# EasyEDA Pro project ProPrj_ProDocument_IO_Board_v3.1_2024-08-01_2024-12-08.epro

# Schematic IO_Board_v3.1
Create Date: 2024-11-05; Page Name: 1. 3.1; Project Name: ProDocument_IO_Board_v3.1_2024-08-01; Schematic Name: IO_Board_v3.1; Update Date: 2024-12-08
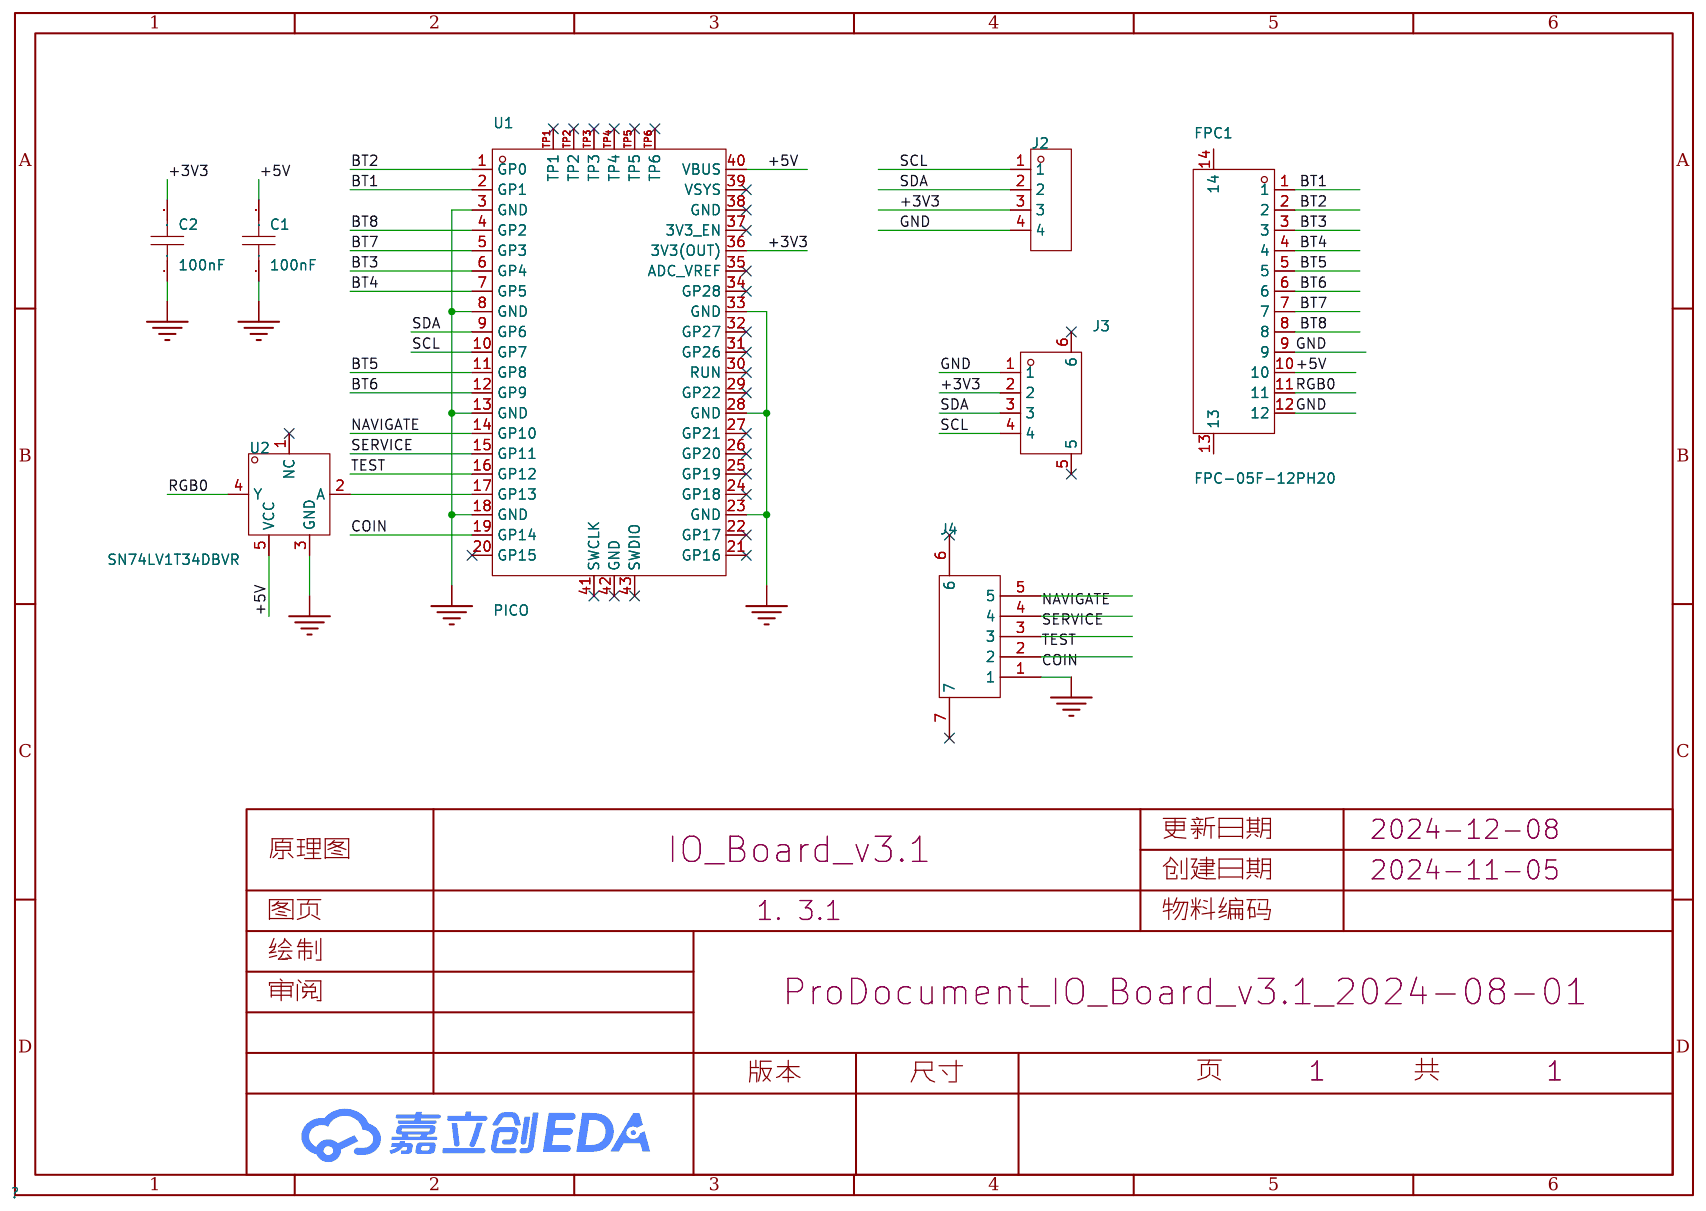
[diagram p0: schematic sheet]

## Parts
C1  100nF  [C0603]
C2  100nF  [C0603]
FPC1  FPC-05F-12PH20  [FPC-SMD_12P-P0.50_FPC-05F-12PH20]
J2  F136-1104S3CMUB2  [CONN-SMD_4P-P2.54_XH2.54-4AB]
J3  AFA01-S04FCA-00  [FPC-SMD_4P-P1.00_JS_AFA01-S04FCA-00]
J4  AFA01-S05FCC-00  [FPC-SMD_P1.00-5P_FGS-XJ-H2.0]
U1  PICO  [COMM-SMD_L51.0-W21.0-P2.54_SC0916]
U2  SN74LV1T34DBVR  [SOT-23-5_L2.9-W1.6-P0.95-LS2.8-BR]

## Library data of the parts
C1 C2 = CAP_0603: Supplier Footprint: 0603
FPC1 = FPC-05F-12PH20: 锁定特性:翻盖式;触点类型:下接;触点数量:12P;间距:0.5mm;安装类型:卧贴;工作温度范围:-25℃~+85℃;; LCSC Part Name: 间距:0.5mm P数:12P 翻盖式 下接; Supplier Part: C2856799; Manufacturer: XUNPU(讯普); Supplier Footprint: SMD,P=0.5mm,卧贴; JLCPCB Part Class: 扩展库; Datasheet: https://atta.szlcsc.com/upload/public/pdf/source/20210922/C2856799_794322F63241F1C59819430844B946BA.pdf; Supplier: LCSC; Locking Feature: 翻盖式; Contact Type: 下接; Number of Contacts: 12P; Pitch: 0.5mm; Mounting Type: 卧贴; FFC, FCB Thickness: 0.3mm; Height Above Board: 2mm; Operating Temperature Range: -25℃~+85℃
J2 = F136-1104S3CMUB2: 插孔结构:1x4P;间距:2.54mm;排数:单排;总孔位数:4P;塑高:3.5mm;触头材质:青铜;触头镀层:锡;工作温度范围:-40℃~+105℃;; LCSC Part Name: 1x4P 间距:2.54mm; Supplier Part: C20071191; Manufacturer: Yxcon(宇熙精密); Supplier Footprint: SMD,P=2.54mm(交错脚); JLCPCB Part Class: 扩展库; Datasheet: https://atta.szlcsc.com/upload/public/pdf/source/20231229/6268F0CB0A5C868446EF560AB6378120.pdf; Supplier: LCSC; Holes Structure: 1x4P; Pitch: 2.54mm; Number of Rows: 单排; Number of Holes: 4P; Insulation Height: 3.5mm; Contact Material: 青铜; Contact Plating: 锡; Operating Temperature Range: -40℃~+105℃
J3 = AFA01-S04FCA-00: 锁定特性:翻盖式;触点类型:下接;触点数量:4P;间距:1mm;安装类型:卧贴;工作温度范围:-20℃~+85℃;; LCSC Part Name: 间距:1mm P数:4P 翻盖式 下接; Supplier Part: C262752; Manufacturer: JS(钜硕电子); Supplier Footprint: SMD,P=1mm,卧贴; JLCPCB Part Class: 扩展库; Datasheet: https://atta.szlcsc.com/upload/public/pdf/source/20180820/C262762_EBECD0847A529CA64FD00527F6604CA9.pdf; Supplier: LCSC; Locking Feature: 翻盖式; Contact Type: 下接; Number of Contacts: 4P; Pitch: 1mm; Mounting Type: 卧贴; FFC, FCB Thickness: 0.3mm; Height Above Board: 2mm; Operating Temperature Range: -20℃~+85℃
J4 = AFA01-S05FCC-00: 锁定特性:翻盖式;触点类型:下接;触点数量:5P;间距:1mm;安装类型:卧贴;; LCSC Part Name: 间距:1mm P数:5P 翻盖式 下接; Supplier Part: C262382; Manufacturer: JS(钜硕电子); Supplier Footprint: SMD,P=1mm,卧贴; JLCPCB Part Class: 扩展库; Datasheet: https://atta.szlcsc.com/upload/public/pdf/source/20180820/C262762_EBECD0847A529CA64FD00527F6604CA9.pdf; Supplier: LCSC; Locking Feature: 翻盖式; Contact Type: 下接; Number of Contacts: 5P; Pitch: 1mm; Mounting Type: 卧贴; FFC, FCB Thickness: 0.3mm; Height Above Board: 2mm
U1 = PICO: "基于Raspberry Pi RP2040芯片设计；处理器：双核Arm Cortex-M0+ @ 133MHz内存：264KB片上SRAM；2MB板上QSPI闪存接口：26个GPIO引脚，包括3个模拟输入；2 × UART；2 × SPI控制器；2 × I2C控制器；16个PWM通道；1 × USB 1.1控制器和PHY，支持主机和设备；8 × PIO状态机"; Supplier Part: C7203002; Manufacturer: Raspberry Pi(树莓派); JLCPCB Part Class: 扩展库; Datasheet: https://atta.szlcsc.com/upload/public/pdf/source/20230906/086376002DDC9866828648BC93E51F8B.pdf; Supplier: LCSC
U2 = SN74LV1T34DBVR: 输入类型:-;电源电压:1.6V~5.5V;元件数:1;每个元件位数:1;灌电流(IOL):8mA;拉电流(IOH):8mA;; Supplier Part: C100024; Manufacturer: TI(德州仪器); Supplier Footprint: SOT-23-5; JLCPCB Part Class: 扩展库; Datasheet: https://www.ti.com/cn/lit/gpn/sn74lv1t34; Supplier: LCSC; output type: 推挽; Supply Voltage: 1.6V~5.5V; Number of Elements: 1; Number of Bits per Element: 1; Sink Current: 8mA; Source Current: 8mA; Logic Family: 74LV; Operating Temperature: -40℃~+125℃

## Nets
+3V3: C2.2 J2.3 J3.2 U1.36(3V3(OUT))
+5V: C1.2 FPC1.10 U1.40(VBUS) U2.5(VCC)
GND: C1.1 C2.1 FPC1.9 FPC1.12 J2.4 J3.1 J4.1 U1.3(GND) U1.8(GND) U1.13(GND) U1.18(GND) U1.23(GND) U1.28(GND) U1.33(GND) U2.3(GND)
BT1: FPC1.1 U1.2(GP1)
BT2: FPC1.2 U1.1(GP0)
BT3: FPC1.3 U1.6(GP4)
BT4: FPC1.4 U1.7(GP5)
BT5: FPC1.5 U1.11(GP8)
BT6: FPC1.6 U1.12(GP9)
BT7: FPC1.7 U1.5(GP3)
BT8: FPC1.8 U1.4(GP2)
COIN: J4.2 U1.19(GP14)
NAVIGATE: J4.5 U1.14(GP10)
RGB0: FPC1.11 U2.4(Y)
SCL: J2.1 J3.4 U1.10(GP7)
SDA: J2.2 J3.3 U1.9(GP6)
SERVICE: J4.4 U1.15(GP11)
TEST: J4.3 U1.16(GP12)
$1N1134: U1.17(GP13) U2.2(A)

Not connected (* = marked no-connect by the designer): FPC1 13 14; J3 5* 6*; J4 6* 7*; U1 20(GP15)* 21(GP16)* 22(GP17)* 24(GP18)* 25(GP19)* 26(GP20)* 27(GP21)* 29(GP22)* 30(RUN)* 31(GP26)* 32(GP27)* 34(GP28)* 35(ADC_VREF)* 37(3V3_EN)* 38(GND)* 39(VSYS)* 41(SWCLK)* 42(GND)* 43(SWDIO)* TP1* TP2* TP3* TP4* TP5* TP6*; U2 1(NC)*

# Board IO_Board_v3.1
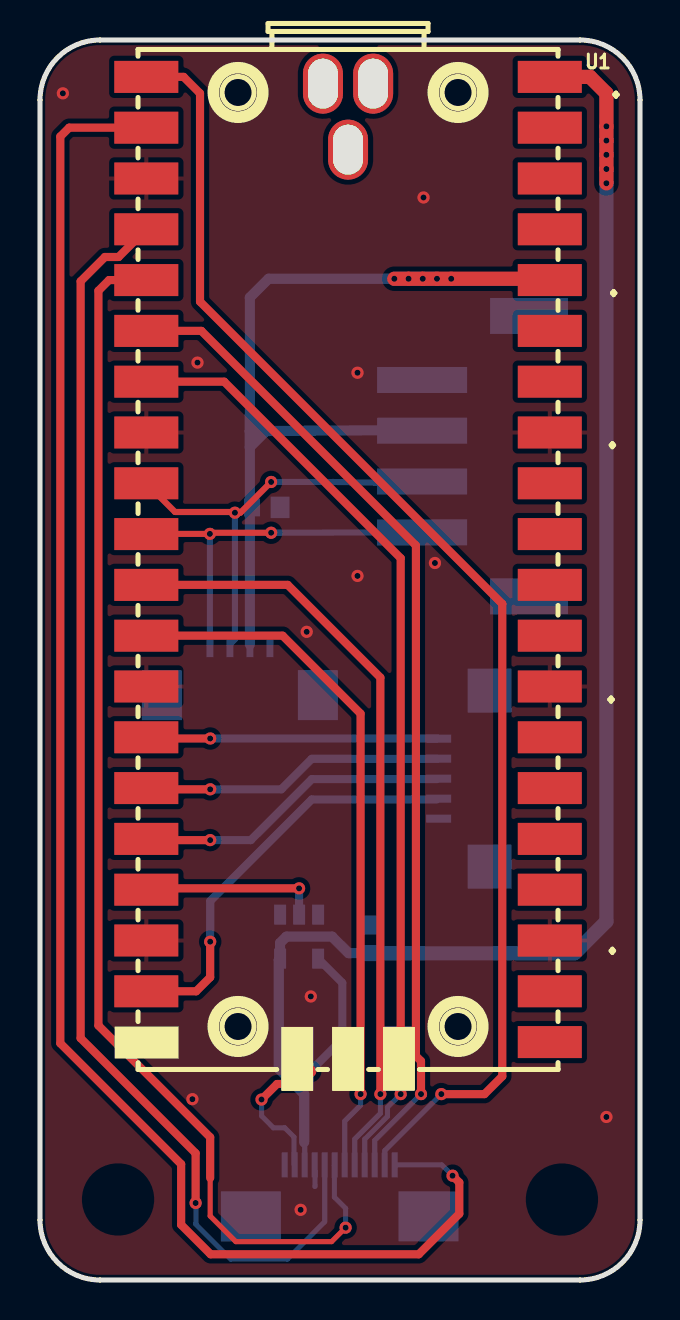
[diagram p1: board, top side]
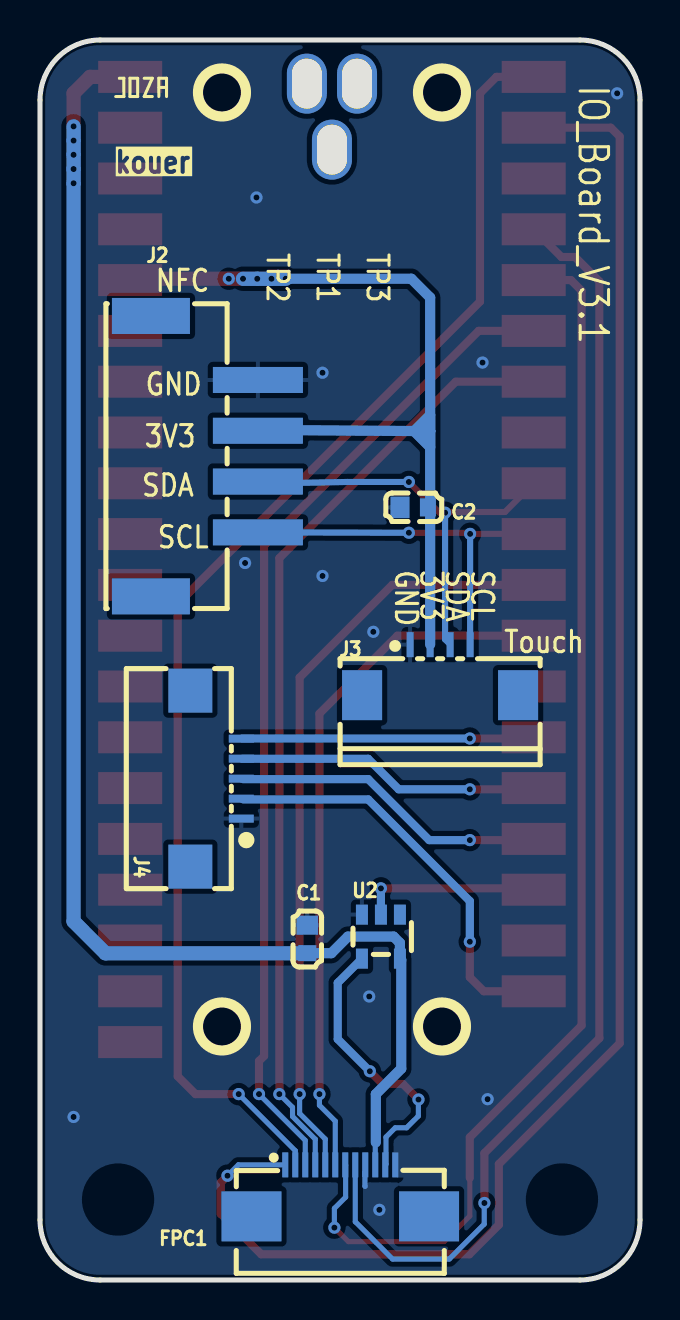
[diagram p2: board, bottom side, seen from below]

Outline 30 x 62 mm; copper layers: Top Layer, Bottom Layer. Coordinates in mm from the lower left corner of the outline.
Outline path: 0,59 0,3 arc(0.88,0.88) 3,0 27,0 arc(29.12,0.88) 30,3 30,59 arc(29.12,61.12) 27,62 3,62 arc(0.88,61.12) 0,59
Stack: Top Layer 0.035mm / Dielectric1 1.51mm FR4 er 4.5 / Bottom Layer 0.035mm

## Design rules (mm)
template: JLCPCB Capability(Two Layers Board)
spacing copperThickness1oz (default): track to track 0.102, other pairs 0.152 to 0.3
spacing copperThickness2oz: track to track 0.203, other pairs 0.152 to 0.3
track width copperThickness1oz (default): min 0.127, default 0.254, max 2.54
track width copperThickness2oz: min 0.203, default 0.254, max 2.54
differential pair differentialPair (default): width min 0.127, default 0.254, max 2.54; gap min 0.152, default 0.152
via viaSize (default): diameter min 0.5, default 0.61, max 10; hole min 0.3, default 0.305, max 6.3

## Placement (name value [footprint] x y rotation side)
C1  100nF  [C0603]  16.64 17.04 270 bottom
C2  100nF  [C0603]  11.3 38.63 180 bottom
FPC1  FPC-05F-12PH20  [FPC-SMD_12P-P0.50_FPC-05F-12PH20]  14.99 4.47 180 bottom
J2  F136-1104S3CMUB2  [CONN-SMD_4P-P2.54_XH2.54-4AB]  21.78 41.19 90 bottom
J3  AFA01-S04FCA-00  [FPC-SMD_4P-P1.00_JS_AFA01-S04FCA-00]  9.99 30.5 180 bottom
J4  AFA01-S05FCC-00  [FPC-SMD_P1.00-5P_FGS-XJ-H2.0]  21.21 25.07 90 bottom
NOREF  -  [Pad_e26]  16.66 59.82 90 top
NOREF#2  -  [Pad_e27]  14.15 59.82 90 top
NOREF#3  -  [Pad_e419]  15.4 56.52 90 top
U1  PICO  [COMM-SMD_L51.0-W21.0-P2.54_SC0916]  15.4 35.71 270 top
U2  SN74LV1T34DBVR  [SOT-23-5_L2.9-W1.6-P0.95-LS2.8-BR]  12.95 17.17 90 bottom

## Footprints (pads in the part's own frame, mm; a bottom-side part is the same pattern mirrored in y, then rotated)
C0603
  rect 0.95x1.075 smd: 1(-0.7,0)
  rect 0.8x0.9 smd: 2(0.7,0)
COMM-SMD_L51.0-W21.0-P2.54_SC0916
  rect 1.6x3.2 smd: 1(-24.445,-10.088) 2(-21.905,-10.088) 3(-19.365,-10.088) 4(-16.825,-10.088) 5(-14.285,-10.088) 6(-11.745,-10.088) 7(-9.205,-10.088) 8(-6.665,-10.088) 9(-4.125,-10.088) 10(-1.585,-10.088) 11(0.955,-10.088) 12(3.495,-10.088) 13(6.035,-10.088) 14(8.575,-10.088) 15(11.115,-10.088) 16(13.655,-10.088) 17(16.195,-10.088) 18(18.735,-10.088) 19(21.275,-10.088) 21(23.815,10.088) 22(21.275,10.088) 23(18.735,10.088) 24(16.195,10.088) 25(13.655,10.088) 26(11.115,10.088) 27(8.575,10.088) 28(6.035,10.088) 29(3.495,10.088) 30(0.955,10.088) 31(-1.585,10.088) 32(-4.125,10.088) 33(-6.665,10.088) 34(-9.205,10.088) 35(-11.745,10.088) 36(-14.285,10.088) 37(-16.825,10.088) 38(-19.365,10.088) 39(-21.905,10.088) 40(-24.445,10.088)
CONN-SMD_4P-P2.54_XH2.54-4AB
  rect 1.3x4.501 smd: 1(-3.81,-2.675) 2(-1.27,-2.675) 3(1.27,-2.675) 4(3.81,-2.675)
  rect 1.801x3.899 smd: 5(-7.011,2.675) 6(7.011,2.675)
FPC-SMD_4P-P1.00_JS_AFA01-S04FCA-00
  rect 0.35x1.25 smd: 1(-1.5,1.262) 2(-0.5,1.262) 3(0.499,1.262) 4(1.5,1.262)
  rect 2x2.5 smd: 5(3.9,-1.262) 6(-3.9,-1.262)
FPC-SMD_12P-P0.50_FPC-05F-12PH20
  rect 0.3x1.25 smd: 1(-2.75,1.288) 2(-2.25,1.288) 3(-1.75,1.288) 4(-1.25,1.288) 5(-0.75,1.288) 6(-0.25,1.288) 7(0.25,1.288) 8(0.75,1.288) 9(1.25,1.288) 10(1.75,1.288) 11(2.25,1.288) 12(2.75,1.288)
  rect 3x2.5 smd: 13(4.44,-1.288) 14(-4.44,-1.288)
FPC-SMD_P1.00-5P_FGS-XJ-H2.0
  rect 0.4x1.25 smd: 1(-2,-1.275) 2(-1.002,-1.274) 3(-0.002,-1.274) 4(0.998,-1.274) 5(1.998,-1.274)
  rect 2.2x2.2 smd: 6(4.4,1.275) 7(-4.4,1.275)
Pad_e26
  oval 3x2 hole 2.5x1.5: 44(0,0)
Pad_e27
  oval 3x2 hole 2.5x1.5: 45(0,0)
Pad_e419
  oval 3x2 hole 2.5x1.5: 45(0,0)
SOT-23-5_L2.9-W1.6-P0.95-LS2.8-BR
  rect 1x0.6 smd: 1(1.1,-0.95) 2(1.1,0) 3(1.1,0.95) 4(-1.1,0.95) 5(-1.1,-0.95)

## Nets
As in the schematic.

Pads without a net: FPC1 13 14; J2 5 6; J3 5 6; J4 6 7; U1 21 22 24 25 26 27 29 30 31 32 34 35 37 38 39; U2 1

## Via types
v1: diameter 0.61, hole 0.305, Top Layer to Bottom Layer, 40 vias

## Routing (per net, layer and track width the routed paths; a pad name or vN(x,y) marks a point on that pad's centre or on a via; arc(x,y) is an arc through that point)
+3V3: length 48
  Top Layer w0.711: v1(17.72,50.06) v1(18.43,50.06) v1(19.14,50.06) v1(19.85,50.06) v1(20.56,50.06) 25.42,50.06 U1.36
  Bottom Layer w0.508: 11.3,42.44 10.49,43.25 10.49,42.44 ; 11.3,42.44 10.49,42.44 ; 11.3,42.44 10.49,42.44 ; 11.3,42.44 10.49,41.64 10.49,42.44 ; 10.49,42.44 10.49,31.78 ; 10.49,42.44 17.97,42.5 18.09,42.38 ; 10.49,42.44 10.49,49.12 11.43,50.06 v1(17.72,50.06)
  Bottom Layer w0.711: v1(17.72,50.06) v1(18.43,50.06) v1(19.14,50.06) v1(19.85,50.06)
+5V: length 76.5
  Top Layer w0.711: v1(28.32,54.84) v1(28.32,55.55) v1(28.32,56.26) v1(28.32,56.97) v1(28.32,57.68) 28.32,59.33 27.5,60.16 U1.40
  Bottom Layer w0.254: 13.21,6.88 13.24,6.85 FPC1.10
  Bottom Layer w0.508: 13.21,6.88 13.21,9.3 11.94,10.56 11.94,16 U2.5 12,16.85 12.32,17.17 14.6,17.17 15.43,16.34 C1.2
  Bottom Layer w0.711: v1(28.32,57.68) v1(28.32,56.97) v1(28.32,56.26) v1(28.32,55.55) v1(28.32,54.84) 28.32,17.93 26.72,16.33 16.64,16.33 C1.2
GND: length 0.8
  Bottom Layer w0.254: 13.74,4.68 13.75,4.69 13.75,5.44
  vias: v1(1.14,59.33) v1(7.62,9.04) v1(7.87,45.87) v1(13.03,3.51) v1(13.34,32.41) v1(13.54,14.18) v1(15.88,45.36) v1(15.88,35.2) v1(19.18,54.13) v1(19.75,35.85) v1(28.32,8.15)
BT1: length 81.9
  Top Layer w0.406: v1(20.63,5.21) 20.96,4.88 20.96,3.31 18.94,1.29 8.53,1.29 7.06,2.76 7.06,5.79 1.02,11.83 1.02,57.17 1.46,57.62 U1.2
  Bottom Layer w0.254: FPC1.1 20.09,5.76 v1(20.63,5.21)
BT2: length 66.6
  Top Layer w0.406: U1.1 7.18,60.16 8,59.33 8,48.92 23.11,33.81 23.11,10.18 22.22,9.3 v1(20.07,9.3)
  Bottom Layer w0.254: FPC1.2 17.24,6.47 v1(20.07,9.3)
BT3: length 50
  Top Layer w0.406: v1(19.05,9.3) 19.05,10.95 18.8,11.2 18.8,36.73 8.07,47.46 U1.6
  Bottom Layer w0.254: v1(19.05,9.3) 16.74,6.98 FPC1.3
BT4: length 47.5
  Top Layer w0.406: U1.7 9.21,44.92 18.03,36.09 v1(18.03,9.3)
  Bottom Layer w0.254: FPC1.4 16.24,7.04 17.37,8.18 17.37,8.64 18,9.26
  Bottom Layer w0.406: 18,9.26 v1(18.03,9.3)
BT5: length 38.5
  Top Layer w0.406: v1(17.02,9.3) 17.02,30.12 12.38,34.76 U1.11
  Bottom Layer w0.254: v1(17.02,9.3) 17.02,8.33 15.74,7.04 FPC1.5
BT6: length 35.2
  Top Layer w0.406: U1.12 12.13,32.22 16.03,28.32 v1(16.03,9.3)
  Bottom Layer w0.254: v1(16.03,9.3) 16.03,8.74 15.24,7.94 FPC1.6
BT7: length 62.2
  Top Layer w0.254: v1(15.28,2.62) 14.58,1.92 9.79,1.92 8.51,3.2 8.51,5.1
  Top Layer w0.406: 8.51,5.1 8.51,7.14 2.92,12.72 2.92,49.46 3.45,50 U1.5
  Bottom Layer w0.254: v1(15.28,2.62) 15.28,3.58 14.72,4.14 14.72,5.74 FPC1.7
BT8: length 64.7
  Top Layer w0.406: U1.4 3.93,51.15 3.25,51.15 2.03,49.94 2.03,12.09 7.78,6.34 v1(7.78,3.85)
  Bottom Layer w0.254: FPC1.8 14.24,2.91 12.37,1.05 9.53,1.05 7.79,2.79 7.79,3.84 v1(7.78,3.85)
COIN: length 20.7
  Top Layer w0.406: v1(8.51,16.92) 8.51,15.14 7.81,14.44 U1.19
  Bottom Layer w0.406: 19.83,24.03 13.59,24.03 8.51,18.95 v1(8.51,16.92)
NAVIGATE: length 14.6
  Top Layer w0.406: U1.14 5.38,27.08 v1(8.51,27.08)
  Bottom Layer w0.406: 19.88,27.08 v1(8.51,27.08)
RGB0: length 14.1
  Top Layer w0.4: v1(11.08,9.02) 11.86,9.8 12.87,9.8 v1(13.51,10.44)
  Bottom Layer w0.254: 11.08,9.02 11.08,9.02 11.08,8.2 11.67,7.61 12.24,7.61 12.7,7.15 12.7,5.79 FPC1.11
  Bottom Layer w0.406: U2.4 15.11,14.86 15.11,12.04 v1(13.51,10.44)
SCL: length 18.5
  Top Layer w0.305: U1.10 5.32,37.31 v1(8.49,37.31) 8.55,37.36 v1(11.56,37.36)
  Bottom Layer w0.305: 18.25,37.39 18.24,37.38 v1(11.56,37.36) ; 8.49,31.78 v1(8.49,37.31)
SDA: length 20.6
  Top Layer w0.305: v1(11.56,39.9) 10.02,38.36 v1(9.75,38.36) 9.71,38.4 6.75,38.4 U1.9
  Bottom Layer w0.305: 9.49,31.78 9.75,32.03 v1(9.75,38.36) ; 17.9,39.95 17.79,39.84 14.63,39.9 v1(11.56,39.9)
SERVICE: length 15.2
  Top Layer w0.406: v1(8.51,24.53) 5.38,24.53 U1.15
  Bottom Layer w0.406: v1(8.51,24.53) 12.06,24.53 13.59,26.06 19.86,26.06
TEST: length 15.8
  Top Layer w0.406: U1.16 5.38,22 v1(8.51,22)
  Bottom Layer w0.406: v1(8.51,22) 10.54,22 13.59,25.04 19.85,25.04
$1N1134: length 9
  Top Layer w0.406: U1.17 5.38,19.58 v1(12.95,19.58)
  Bottom Layer w0.406: U2.2 v1(12.95,19.58)

## Copper pours and planes (outline as drawn; the poured copper is in the pictures)
GND on Top Layer: -8.38,73.56 34.54,73.56 34.54,-4.29 -8.38,-4.29
GND on Bottom Layer: 10.64,6.99 12.32,6.99 12.32,5.12 10.64,5.12
GND on Bottom Layer: -10.82,68.36 32.78,68.36 32.78,-3.96 -10.82,-3.96

## Text on the board
Bottom Silkscreen Layer: TP3 | TP1 | TP2 | kouer | SCL | SDA | 3V3 | GND | Touch | NFC | IO_Board_V3.1
Top Silkscreen Layer: .
